# Altium schematic sheet analog.SchDoc: Digital
size A4; DrawnBy: ZXR; DocumentNumber: 20251214; Revision: 1.0; SheetNumber: 1; SheetTotal: 2
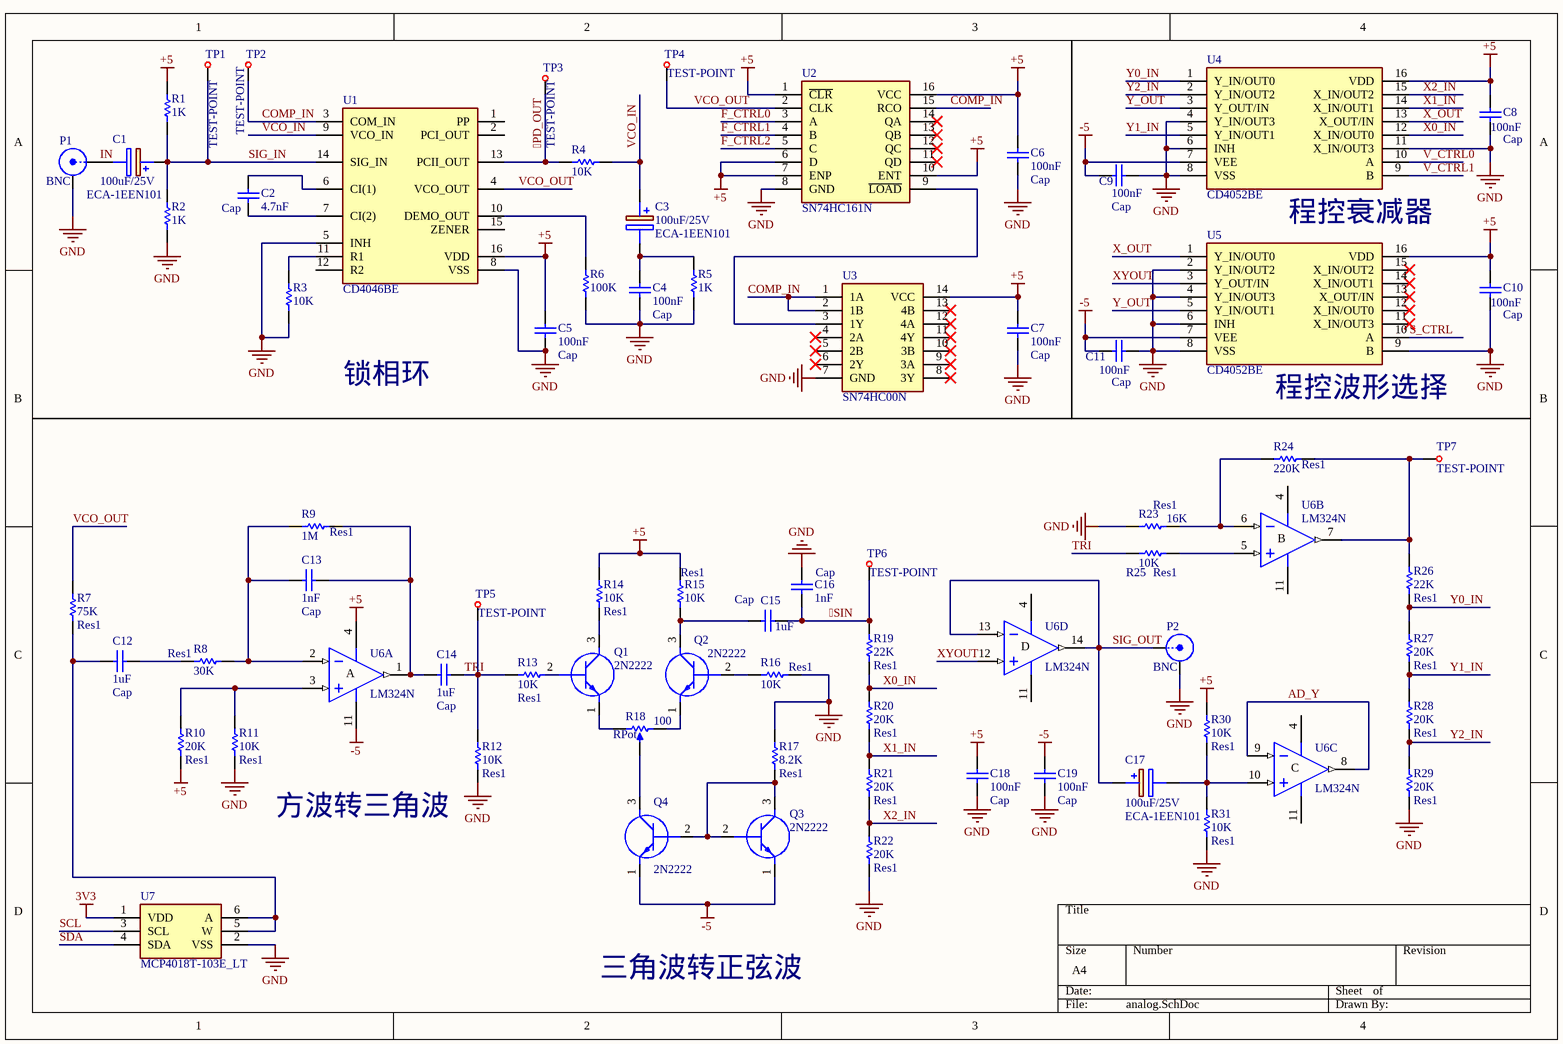
[diagram p0: analog.SchDoc]

## Parts
C1  ECA-1EEN101  value 100uF/25V  [CAPPRD350W65D800H1250]
C2  Cap  value 4.7nF  [RAD-0.2-cap]
C3  ECA-1EEN101  value 100uF/25V  [CAPPRD350W65D800H1250]
C4  Cap  value 100nF  [RAD-0.2-cap]
C5  Cap  value 100nF  [RAD-0.2-cap]
C6  Cap  value 100nF  [RAD-0.2-cap]
C7  Cap  value 100nF  [RAD-0.2-cap]
C8  Cap  value 100nF  [RAD-0.2-cap]
C9  Cap  value 100nF  [RAD-0.2-cap]
C10  Cap  value 100nF  [RAD-0.2-cap]
C11  Cap  value 100nF  [RAD-0.2-cap]
C12  Cap  value 1uF  [RAD-0.2-cap]
C13  Cap  value 1nF  [RAD-0.2-cap]
C14  Cap  value 1uF  [RAD-0.2-cap]
C15  Cap  value 1uF  [RAD-0.2-cap]
C16  Cap  value 1nF  [RAD-0.2-cap]
C17  ECA-1EEN101  value 100uF/25V  [CAPPRD350W65D800H1250]
C18  Cap  value 100nF  [RAD-0.2-cap]
C19  Cap  value 100nF  [RAD-0.2-cap]
P1  BNC  [BNC_RA-CON]
P2  BNC  [BNC_RA-CON]
Q1  2N2222  [TO-92-3]
Q2  2N2222  [TO-92-3]
Q3  2N2222  [TO-92-3]
Q4  2N2222  [TO-92-3]
R1  1K  [RES-AXIAL-0.4]
R2  1K  [RES-AXIAL-0.4]
R3  10K  [RES-AXIAL-0.4]
R4  10K  [RES-AXIAL-0.4]
R5  1K  [RES-AXIAL-0.4]
R6  100K  [RES-AXIAL-0.4]
R7  Res1  value 75K  [RES-AXIAL-0.4]
R8  Res1  value 30K  [RES-AXIAL-0.4]
R9  Res1  value 1M  [RES-AXIAL-0.4]
R10  Res1  value 20K  [RES-AXIAL-0.4]
R11  Res1  value 10K  [RES-AXIAL-0.4]
R12  Res1  value 10K  [RES-AXIAL-0.4]
R13  Res1  value 10K  [RES-AXIAL-0.4]
R14  Res1  value 10K  [RES-AXIAL-0.4]
R15  Res1  value 10K  [RES-AXIAL-0.4]
R16  Res1  value 10K  [RES-AXIAL-0.4]
R17  Res1  value 8.2K  [RES-AXIAL-0.4]
R18  RPot  value 100  [3269W]
R19  Res1  value 22K  [RES-AXIAL-0.4]
R20  Res1  value 20K  [RES-AXIAL-0.4]
R21  Res1  value 20K  [RES-AXIAL-0.4]
R22  Res1  value 20K  [RES-AXIAL-0.4]
R23  Res1  value 16K  [RES-AXIAL-0.4]
R24  Res1  value 220K  [RES-AXIAL-0.4]
R25  Res1  value 10K  [RES-AXIAL-0.4]
R26  Res1  value 22K  [RES-AXIAL-0.4]
R27  Res1  value 20K  [RES-AXIAL-0.4]
R28  Res1  value 20K  [RES-AXIAL-0.4]
R29  Res1  value 20K  [RES-AXIAL-0.4]
R30  Res1  value 10K  [RES-AXIAL-0.4]
R31  Res1  value 10K  [RES-AXIAL-0.4]
TP1  TEST-POINT  [TP]
TP2  TEST-POINT  [TP]
TP3  TEST-POINT  [TP]
TP4  TEST-POINT  [TP]
TP5  TEST-POINT  [TP]
TP6  TEST-POINT  [TP]
TP7  TEST-POINT  [TP]
U1  CD4046BE  [DIP794W53P254L1930H508Q16N]
U2  SN74HC161N  [DIP794W53P254L1930H508Q16N]
U3  SN74HC00N  [DIP794W53P254L1930H508Q14N]
U4  CD4052BE  [DIP794W53P254L1930H508Q16N]
U5  CD4052BE  [DIP794W53P254L1930H508Q16N]
U6  LM324N  [DIP794W53P254L1930H508Q14N]  (parts A,B,C,D of 4)
U7  MCP4018T-103E_LT  [DIP762W60P254L730H450Q6N]

## Nets
3V3: U7.1(VDD)
+5: C5.2 C6.2 C7.2 C8.2 C10.2 C18.2 R1.2 R10.2 R14.2 R15.2 R30.2 U1.16(VDD) U2.1(~{CLR}) U2.6(D) U2.7(ENP) U2.10(ENT) U2.16(VCC) U3.14(VCC) U4.16(VDD) U5.16(VDD) U6.4(V+)
-5: C9.1 C11.2 C19.2 Q3.1(E) Q4.1(E) U4.7(VEE) U5.7(VEE) U6.11(V-)
GND: C4.1 C5.1 C6.1 C7.1 C8.1 C9.2 C10.1 C11.1 C16.2 C18.1 C19.1 P1.2(Y) P2.2(Y) R2.1 R3.1 R5.1 R6.1 R11.2 R12.2 R16.1 R17.1 R22.1 R23.2 R29.1 R31.1 U1.5(INH) U1.8(VSS) U2.8(GND) U3.7(GND) U4.4(Y_IN/OUT3) U4.6(INH) U4.8(VSS) U4.11(X_IN/OUT3) U5.2(Y_IN/OUT2) U5.4(Y_IN/OUT3) U5.6(INH) U5.8(VSS) U5.9(B) U7.2(VSS)
PD_OUT: R4.2 TP3.1 U1.13(PCII_OUT)
SIN: C15.2 C16.1 R19.2 TP6.1
AD_Y: U6.8(OUT) U6.9(IN-)
COMP_IN: TP2.1 U1.3(COM_IN) U2.15(RCO) U3.1(1A) U3.2(1B)
F_CTRL0: U2.3(A)
F_CTRL1: U2.4(B)
F_CTRL2: U2.5(C)
IN: C1.2(-) P1.1(X)
S_CTRL: U5.10(A)
SCL: U7.3(SCL)
SDA: U7.4(SDA)
SIG_IN: C1.1(+) R1.1 R2.2 TP1.1 U1.14(SIG_IN)
SIG_OUT: C17.1(+) P2.1(X) U6.13(IN-) U6.14(OUT)
TRI: C14.2 R12.1 R13.1 R25.2 TP5.1
V_CTRL0: U4.10(A)
V_CTRL1: U4.9(B)
VCO_IN: C3.1(+) R4.1 U1.9(VCO_IN)
VCO_OUT: R7.2 TP4.1 U1.4(VCO_OUT) U2.2(CLK)
X0_IN: R19.1 R20.2 U4.12(X_IN/OUT0)
X1_IN: R20.1 R21.2 U4.14(X_IN/OUT1)
X2_IN: R21.1 R22.2 U4.15(X_IN/OUT2)
X_OUT: U4.13(X_OUT/IN) U5.1(Y_IN/OUT0)
XYOUT: U5.3(Y_OUT/IN) U6.12(IN+)
Y0_IN: R26.1 R27.2 U4.1(Y_IN/OUT0)
Y1_IN: R27.1 R28.2 U4.5(Y_IN/OUT1)
Y2_IN: R28.1 R29.2 U4.2(Y_IN/OUT2)
Y_OUT: U4.3(Y_OUT/IN) U5.5(Y_IN/OUT1)
NetC2_1: C2.1 U1.7(CI(2))
NetC2_2: C2.2 U1.6(CI(1))
NetC3_2: C3.2(-) C4.2 R5.2
NetC12_1: C12.1 R7.1 U7.5(W) U7.6(A)
NetC12_2: C12.2 R8.2
NetC13_1: C13.1 R8.1 R9.2 U6.2(IN-)
NetC13_2: C13.2 C14.1 R9.1 U6.1(OUT)
NetC15_1: C15.1 Q2.3(C) R15.1
NetC17_2: C17.2(-) R30.1 R31.2 U6.10(IN+)
NetQ1_1: Q1.1(E) R18.1(TOP)
NetQ1_2: Q1.2(B) R13.2
NetQ1_3: Q1.3(C) R14.1
NetQ2_1: Q2.1(E) R18.3(BOT)
NetQ2_2: Q2.2(B) R16.2
NetQ3_2: Q3.2(B) Q3.3(C) Q4.2(B) R17.2
NetQ4_3: Q4.3(C) R18.2(TAP)
NetR3_2: R3.2 U1.11(R1)
NetR6_2: R6.2 U1.10(DEMO_OUT)
NetR10_1: R10.1 R11.1 U6.3(IN+)
NetR23_1: R23.1 R24.1 U6.6(IN-)
NetR24_2: R24.2 R26.2 TP7.1 U6.7(OUT)
NetR25_1: R25.1 U6.5(IN+)
NetU2_9: U2.9(~{LOAD}) U3.3(1Y)

Not connected (* = marked no-connect by the designer): U1 1(PP) 2(PCI_OUT) 12(R2) 15(ZENER); U2 11(QD)* 12(QC)* 13(QB)* 14(QA)*; U3 4(2A)* 5(2B)* 6(2Y)* 8(3Y)* 9(3A)* 10(3B)* 11(4Y)* 12(4A)* 13(4B)*; U5 11(X_IN/OUT3)* 12(X_IN/OUT0)* 13(X_OUT/IN)* 14(X_IN/OUT1)* 15(X_IN/OUT2)*

## Notes on the sheet
- 程控衰减器
- 锁相环
- (near U5) 程控波形选择
- (near R11) 方波转三角波
- 三角波转正弦波
- (in symbol LM324N, part A) A
- (in symbol LM324N, part B) B
- (in symbol LM324N, part C) C
- (in symbol LM324N, part D) D

## Library data of the parts
C1 C3 C17 = ECA-1EEN101: Capacitor Polarised; Manufacturer_Name: Panasonic; Datasheet Link: https://www.mouser.in/datasheet/2/315/ABA0000C1044-947503.pdf; Height: 12.5mm; Manufacturer_Part_Number: ECA-1EEN101; Mouser Part Number: 667-ECA-1EEN101; Mouser Price/Stock: https://www.mouser.co.uk/ProductDetail/Panasonic/ECA-1EEN101?qs=tfZGHB2PWd0NYnCl82fG3g%3D%3D
C2 C4-C16 C18 C19 = Cap: Capacitor; Published: 8-Jun-2000; LatestRevisionDate: 17-Jul-2002; LatestRevisionNote: Re-released for DXP Platform.; PackageReference: RAD-0.3; Publisher: Altium Limited; PackageDescription: Radial Cap, Thru-Hole; 2 Leads; 0.3 in Pin Spacing
P1 P2 = BNC: BNC Elbow Connector; LatestRevisionDate: 17-Jul-2002; LatestRevisionNote: Re-released for DXP Platform.; Publisher: Altium Limited
Q1-Q4 = 2N2222: Transistor BJT NPN; Manufacturer_Name: onsemi; Manufacturer_Part_Number: SS8050CTA; Datasheet Link: http://www.onsemi.com/pub/Collateral/SS8050-D.pdf; Mouser Part Number: 512-SS8050CTA; Mouser Price/Stock: https://www.mouser.co.uk/ProductDetail/ON-Semiconductor-Fairchild/SS8050CTA?qs=UMEuL5FsraCvGU9pAIJ0vg%3D%3D; Arrow Part Number: SS8050CTA; Arrow Price/Stock: https://www.arrow.com/en/products/ss8050cta/on-semiconductor?region=europe
R1-R6 R8-R17 R19-R31 = Res1: Resistor; Published: 8-Jun-2000; LatestRevisionDate: 17-Jul-2002; LatestRevisionNote: Re-released for DXP Platform.; PackageReference: AXIAL-0.3; Publisher: Altium Limited; PackageDescription: Axial Device, Thru-Hole; 2 Leads; 0.3 in Pin Spacing
  R1 R2 R5: Value: 1K
  R3 R4: Value: 10K
  R6: Value: 100K
R18 = RPot: Potentiometer; Sim Note: Enter the Resistance value and the set point into parameter fields.; Set Position: 0.5; Published: 8-Jun-2000; LatestRevisionDate: 17-Jul-2002; LatestRevisionNote: Re-released for DXP Platform.; PackageReference: VR5; Publisher: Altium Limited; PackageDescription: Variable Resistor, Thru-Hole; 3 Leads
TP1-TP7 = TP: Socket; LatestRevisionDate: 17-Jul-2002; LatestRevisionNote: Re-released for DXP Platform.; Publisher: Altium Limited
U1 = CD4046BE: Integrated Circuit; Manufacturer_Name: Texas Instruments; Datasheet Link: http://www.ti.com/lit/gpn/cd4046b; Height: 5.08mm; Manufacturer_Part_Number: CD4046BE; Mouser Part Number: 595-CD4046BE; Mouser Price/Stock: https://www.mouser.co.uk/ProductDetail/Texas-Instruments/CD4046BE?qs=fvkeCqCHl3AX2sxIYB2bdg%3D%3D; Arrow Part Number: CD4046BE; Arrow Price/Stock: https://www.arrow.com/en/products/cd4046be/texas-instruments?utm_currency=USD&region=europe
U2 = SN74HC161N: Integrated Circuit; Manufacturer_Name: Texas Instruments; Datasheet Link: http://www.ti.com/lit/gpn/sn74hc161; Height: 5.08mm; Manufacturer_Part_Number: SN74HC161N; Mouser Part Number: 595-SN74HC161N; Mouser Price/Stock: https://www.mouser.co.uk/ProductDetail/Texas-Instruments/SN74HC161N?qs=bvpNxolhIUP7VQyQMWPUIQ%3D%3D; Arrow Part Number: SN74HC161N; Arrow Price/Stock: https://www.arrow.com/en/products/sn74hc161n/texas-instruments
U3 = SN74HC00N: Integrated Circuit; Manufacturer_Name: Texas Instruments; Datasheet Link: http://componentsearchengine.com/Datasheets/3/SN74HC00N.pdf; Height: 5.08mm; Manufacturer_Part_Number: SN74HC00N; Mouser Part Number: 595-SN74HC00N; Mouser Price/Stock: https://www.mouser.co.uk/ProductDetail/Texas-Instruments/SN74HC00N?qs=st7IWvlL5%2FiRVQxNj4BeMw%3D%3D; Arrow Part Number: SN74HC00N; Arrow Price/Stock: https://www.arrow.com/en/products/sn74hc00n/texas-instruments?utm_currency=USD&region=nac
U4 U5 = CD4052BE: Integrated Circuit; Manufacturer_Name: Texas Instruments; Datasheet Link: http://www.ti.com/lit/gpn/cd4052b; Height: 5.08mm; Manufacturer_Part_Number: CD4052BE; Mouser Part Number: 595-CD4052BE; Mouser Price/Stock: https://www.mouser.co.uk/ProductDetail/Texas-Instruments/CD4052BE?qs=Tv815z3GeNSSxm5loQgO7w%3D%3D; Arrow Part Number: CD4052BE; Arrow Price/Stock: https://www.arrow.com/en/products/cd4052be/texas-instruments?region=nac
U6 = LM324N: Quadruple Operational Amplifier; Published: 16-Jan-2001; LatestRevisionDate: 04-Mar-2005; LatestRevisionNote: Stylized 3D Model Added.; DatasheetVersion: Feb-1997; PackageVersion: Oct-1995; PackageReference: N014; Publisher: Altium Limited; PackageDescription: DIP; 14 Leads; Row Spacing 7.62 mm; Pitch 2.54 mm; ComponentLink1Description: Manufacturer Link; ComponentLink1URL: http://www.ti.com/; ComponentLink2Description: Datasheet; ComponentLink2URL: http://www-s.ti.com/sc/ds/lm324.pdf
U7 = MCP4018T-103E_LT: Integrated Circuit; Manufacturer_Name: Microchip; Manufacturer_Part_Number: MCP4018T-103E/LT; Datasheet Link: https://datasheet.datasheetarchive.com/originals/distributors/Datasheets-DGA14/624353.pdf; Height: 1.1mm; Mouser Part Number: 579-MCP4018T103E/LT; Mouser Price/Stock: https://www.mouser.co.uk/ProductDetail/Microchip-Technology/MCP4018T-103E-LT?qs=%2FsslhGPpiOSWJSDZcNYXEg%3D%3D; Arrow Part Number: MCP4018T-103E/LT; Arrow Price/Stock: https://www.arrow.com/en/products/mcp4018t-103elt/microchip-technology?region=nac
R7 = Res1: Published: 8-Jun-2000; LatestRevisionDate: 17-Jul-2002; LatestRevisionNote: Re-released for DXP Platform.; PackageReference: AXIAL-0.3; Publisher: Altium Limited; PackageDescription: Axial Device, Thru-Hole; 2 Leads; 0.3 in Pin Spacing